# Altium schematic sheet LCD2004.SchDoc
size A4
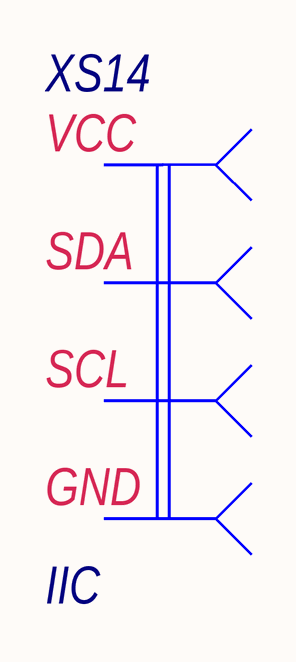
[diagram p0: LCD2004.SchDoc]

## Parts
XS14  IIC  [PLD1X4]

## Nets

Not connected (* = marked no-connect by the designer): XS14 1 2 3 4

## Notes on the sheet
- (in symbol LCD_IIC) VCC; SDA; SCL; GND

## Library data of the parts
XS14 = LCD_IIC: Value: Connector; Published: 07.03.2013; Publisher: Andrew Danich; Type: Розетка